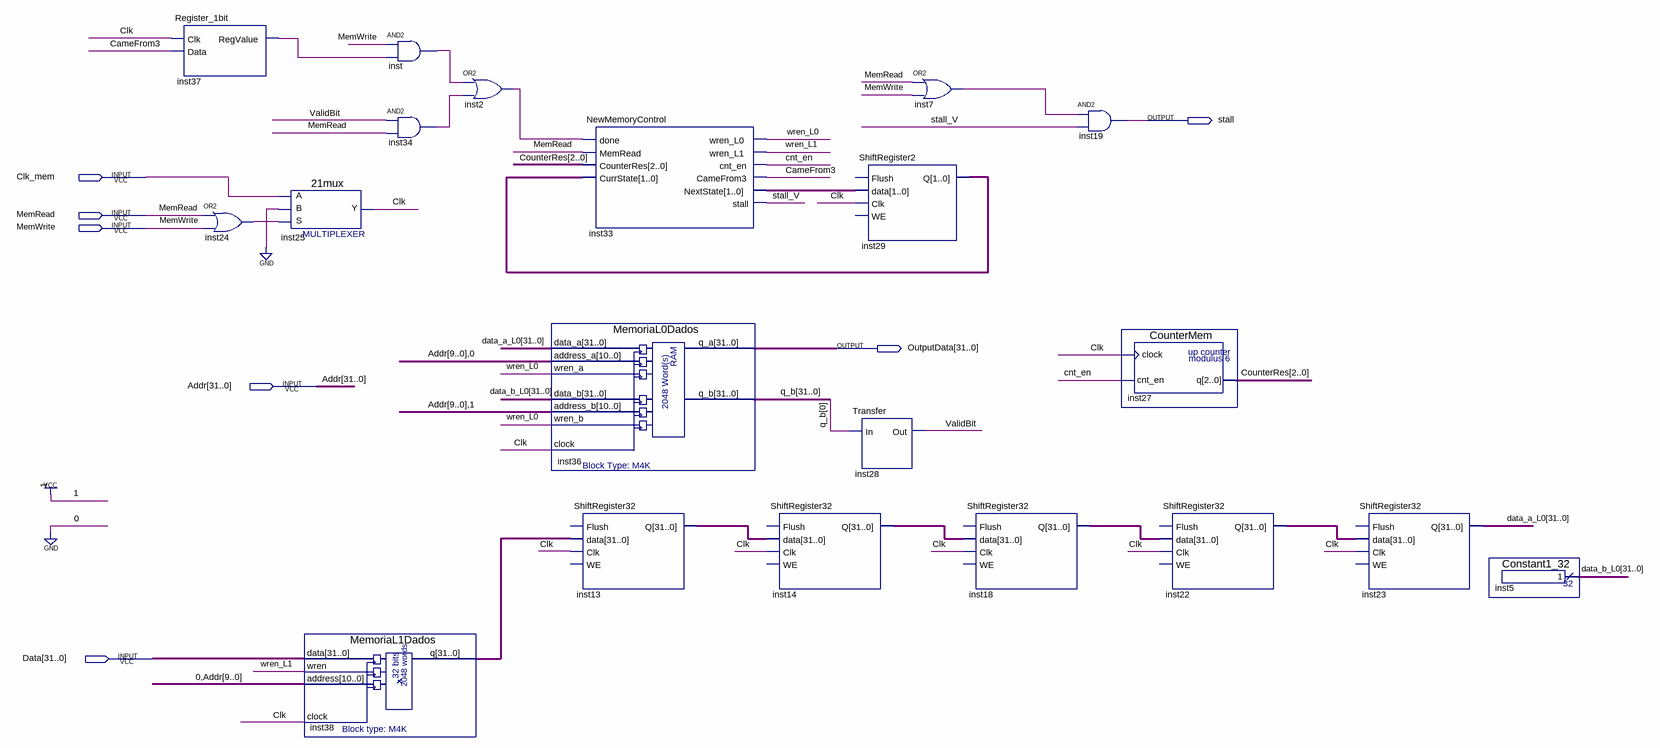
[diagram p0: schematic sheet]
// Quartus schematic NewDataMemory.bdf as structural Verilog: 20 symbols, 7 pins
module NewDataMemory (
  input  Clk_mem,
  input  MemRead,
  input  MemWrite,
  input  [31:0] Addr,
  input  [31:0] Data,
  output stall,
  output [31:0] OutputData
);

  wire CameFrom3, Clk, cnt_en, inst2_out, inst7_out, inst24_out, inst34_out, inst37_regvalue, inst_out,
       stall_V, ValidBit, wren_L0, wren_L1;
  wire [1:0] inst29_q, inst33_nextstate;
  wire [2:0] CounterRes;
  wire [31:0] data_a_L0, data_b_L0, inst13_q, inst14_q, inst18_q, inst22_q, inst38_q, q_b;

  Register_1bit inst37 (.Clk(Clk), .Data(CameFrom3), .RegValue(inst37_regvalue));
  or inst24 (inst24_out, MemRead, MemWrite);
  \21mux  inst25 (.S(inst24_out), .B(1'b0), .A(Clk_mem), .Y(Clk));
  MemoriaL1Dados inst38 (.data(Data), .wren(wren_L1), .address({1'b0, Addr[9:0]}), .clock(Clk), .q(inst38_q));
  and inst (inst_out, MemWrite, inst37_regvalue);
  and inst34 (inst34_out, ValidBit, MemRead);
  or inst2 (inst2_out, inst_out, inst34_out);
  MemoriaL0Dados inst36 (
    .data_a(data_a_L0), .address_a({Addr[9:0], 1'b0}), .wren_a(wren_L0), .data_b(data_b_L0),
    .address_b({Addr[9:0], 1'b1}), .wren_b(wren_L0), .clock(Clk), .q_a(OutputData), .q_b(q_b));
  ShiftRegister32 inst13 (.data(inst38_q), .Clk(Clk), .Q(inst13_q));  // open: Flush, WE
  NewMemoryControl inst33 (
    .done(inst2_out), .MemRead(MemRead), .CounterRes(CounterRes), .CurrState(inst29_q), .wren_L0(wren_L0),
    .wren_L1(wren_L1), .cnt_en(cnt_en), .CameFrom3(CameFrom3), .NextState(inst33_nextstate), .stall(stall_V));
  ShiftRegister32 inst14 (.data(inst13_q), .Clk(Clk), .Q(inst14_q));  // open: Flush, WE
  ShiftRegister2 inst29 (.data(inst33_nextstate), .Clk(Clk), .Q(inst29_q));  // open: Flush, WE
  Transfer inst28 (.In(q_b[0]), .Out(ValidBit));
  or inst7 (inst7_out, MemRead, MemWrite);
  ShiftRegister32 inst18 (.data(inst14_q), .Clk(Clk), .Q(inst18_q));  // open: Flush, WE
  and inst19 (stall, inst7_out, stall_V);
  CounterMem inst27 (.clock(Clk), .cnt_en(cnt_en), .q(CounterRes));
  ShiftRegister32 inst22 (.data(inst18_q), .Clk(Clk), .Q(inst22_q));  // open: Flush, WE
  ShiftRegister32 inst23 (.data(inst22_q), .Clk(Clk), .Q(data_a_L0));  // open: Flush, WE
  Constant1_32 inst5 (.result(data_b_L0));
endmodule
